# Altium schematic sheet Main.SchDoc
size A4
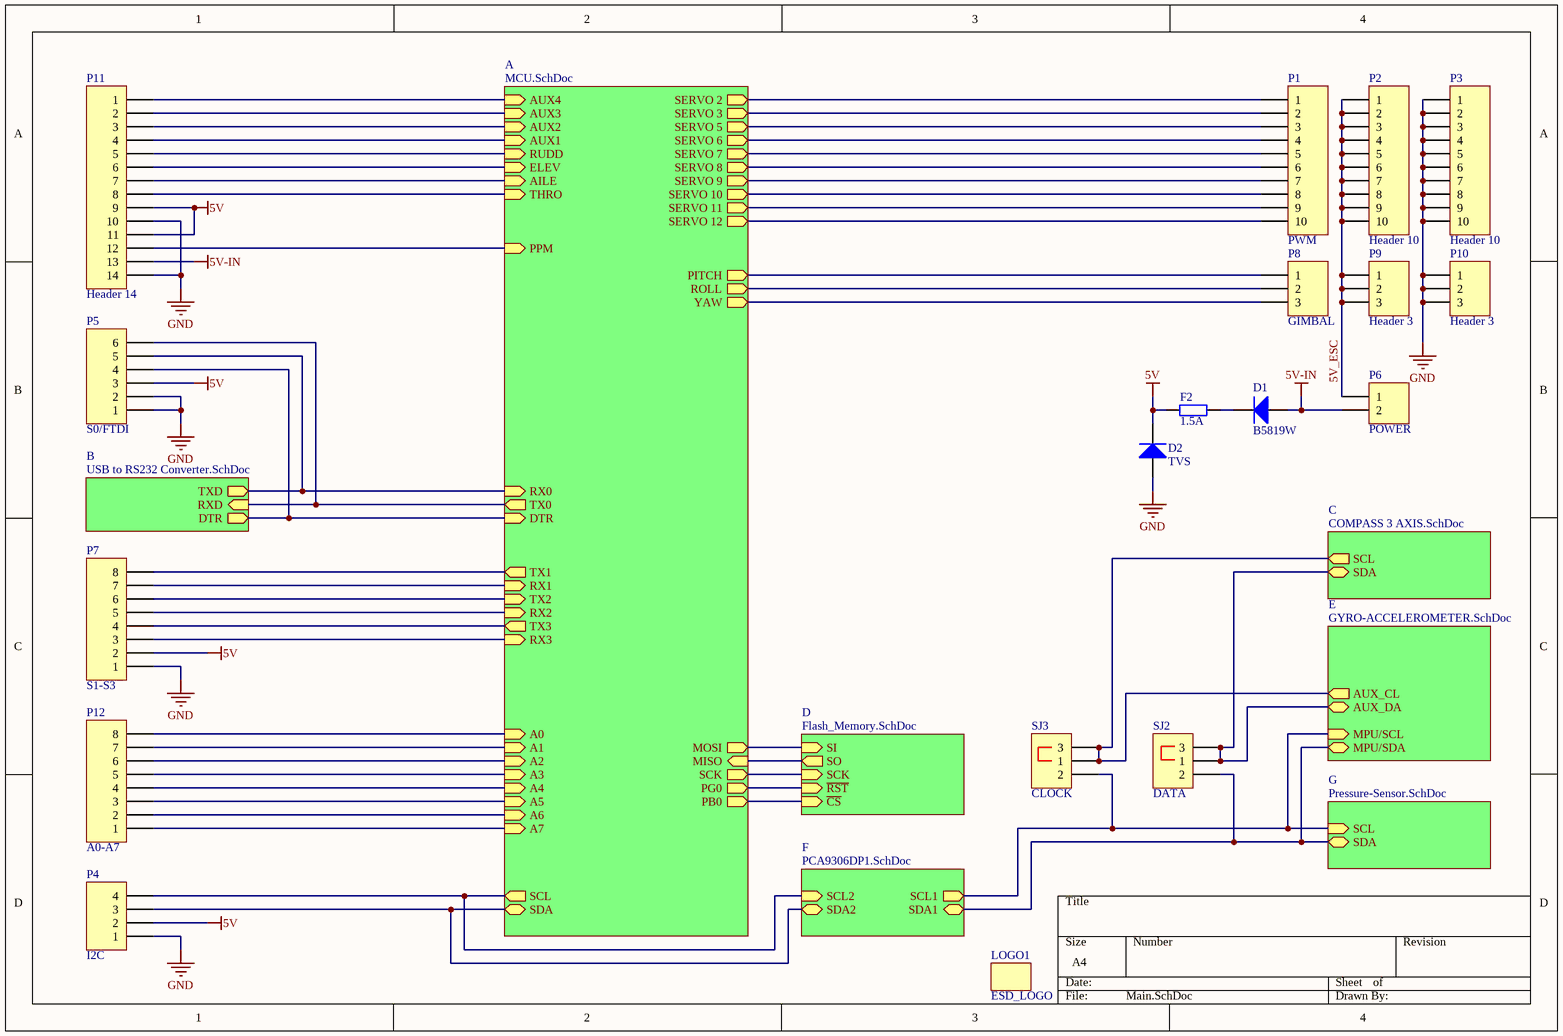
[diagram p0: Main.SchDoc]

## Parts
D1  B5819W  [SOD-123]
D2  TVS  [SOD-123]
F2  1.5A  [FUSE_1206(3216)]
LOGO1  ESD_LOGO  [LOGO_ESD]  (no BOM)
P1  PWM  [Pin Header 1x10 TH Pitch 2.54mm]
P2  Header 10  [Pin Header 1x10 TH Pitch 2.54mm]
P3  Header 10  [Pin Header 1x10 TH Pitch 2.54mm]
P4  I2C  [MOLEX-CONN-PicoBlade 4POS 1.25MM]
P5  S0/FTDI  [MOLEX-CONN-PicoBlade 6POS 1.25MM]
P6  POWER  [Pin Header S/M 02x1 TH Pitch 2.54mm]
P7  S1-S3  [MOLEX-CONN-PicoBlade 8POS 1.25MM]
P8  GIMBAL  [Pin Header 1x3 TH Pitch 2.54mm]
P9  Header 3  [Pin Header 1x3 TH Pitch 2.54mm]
P10  Header 3  [Pin Header 1x3 TH Pitch 2.54mm]
P11  Header 14  [Pin Header 1x14 TH Pitch 2.54mm]
P12  A0-A7  [MOLEX-CONN-PicoBlade 8POS 1.25MM]
SJ2  DATA  [JUMPER_3]
SJ3  CLOCK  [JUMPER_3]

## Sub-sheets
A = MCU.SchDoc: A5 (in), A4 (in), A7 (in), A2 (in), A0 (in), A3 (in), A6 (in), A1 (in), SERVO 10 (out), SERVO 2 (out), YAW (out), SERVO 6 (out), SERVO 9 (out), SERVO 8 (out), SERVO 5 (out), SERVO 3 (out), PITCH (out), SERVO 7 (out), ROLL (out), SERVO 12 (out), SERVO 11 (out), TX2 (in), RX1 (in), TX1 (out), TX3 (out), RX2 (in), RX3 (in), AILE (in), AUX1 (in), AUX4 (in), RUDD (in), AUX3 (in), THRO (in), AUX2 (in), ELEV (in), RX0 (in), TX0 (out), SCL (out), SDA (bidir), SCK (out), MOSI (out), MISO (in), PG0 (out), PB0 (out), PPM (in), DTR (in)
B = USB to RS232 Converter.SchDoc: TXD (out), RXD (in), DTR (out)
C = COMPASS 3 AXIS.SchDoc: SCL (out), SDA (bidir)
D = Flash_Memory.SchDoc: SO (out), ~{RST} (in), SCK (in), SI (in), ~{CS} (in)
E = GYRO-ACCELEROMETER.SchDoc: MPU/SDA (bidir), MPU/SCL (in), AUX_DA (bidir), AUX_CL (out)
F = PCA9306DP1.SchDoc: SDA1 (bidir), SDA2 (bidir), SCL1 (out), SCL2 (in)
G = Pressure-Sensor.SchDoc: SDA (bidir), SCL (in)

## Nets
5V: D2.1(A) F2.2 P4.2 P5.3 P7.2 P11.9 P11.11
5V-IN: D1.2(K) P6.2 P11.13
GND: D2.2(K) P3.1 P3.2 P3.3 P3.4 P3.5 P3.6 P3.7 P3.8 P3.9 P3.10 P4.1 P5.1 P5.2 P7.1 P10.1 P10.2 P10.3 P11.10 P11.14
5V_ESC: P2.1 P2.2 P2.3 P2.4 P2.5 P2.6 P2.7 P2.8 P2.9 P2.10 P6.1 P9.1 P9.2 P9.3
NetD1_1: D1.1(A) F2.1
NetP1_1: P1.1 ; sheet A/SERVO 2
NetP1_2: P1.2 ; sheet A/SERVO 3
NetP1_3: P1.3 ; sheet A/SERVO 5
NetP1_4: P1.4 ; sheet A/SERVO 6
NetP1_5: P1.5 ; sheet A/SERVO 7
NetP1_6: P1.6 ; sheet A/SERVO 8
NetP1_7: P1.7 ; sheet A/SERVO 9
NetP1_8: P1.8 ; sheet A/SERVO 10
NetP1_9: P1.9 ; sheet A/SERVO 11
NetP1_10: P1.10 ; sheet A/SERVO 12
NetP4_3: P4.3 ; sheet A/SDA, sheet F/SDA2
NetP4_4: P4.4 ; sheet A/SCL, sheet F/SCL2
NetP5_4: P5.4 ; sheet A/DTR, sheet B/DTR
NetP5_5: P5.5 ; sheet A/RX0, sheet B/TXD
NetP5_6: P5.6 ; sheet A/TX0, sheet B/RXD
NetP7_3: P7.3 ; sheet A/RX3
NetP7_4: P7.4 ; sheet A/TX3
NetP7_5: P7.5 ; sheet A/RX2
NetP7_6: P7.6 ; sheet A/TX2
NetP7_7: P7.7 ; sheet A/RX1
NetP7_8: P7.8 ; sheet A/TX1
NetP8_1: P8.1 ; sheet A/PITCH
NetP8_2: P8.2 ; sheet A/ROLL
NetP8_3: P8.3 ; sheet A/YAW
NetP11_1: P11.1 ; sheet A/AUX4
NetP11_2: P11.2 ; sheet A/AUX3
NetP11_3: P11.3 ; sheet A/AUX2
NetP11_4: P11.4 ; sheet A/AUX1
NetP11_5: P11.5 ; sheet A/RUDD
NetP11_6: P11.6 ; sheet A/ELEV
NetP11_7: P11.7 ; sheet A/AILE
NetP11_8: P11.8 ; sheet A/THRO
NetP11_12: P11.12 ; sheet A/PPM
NetP12_1: P12.1 ; sheet A/A7
NetP12_2: P12.2 ; sheet A/A6
NetP12_3: P12.3 ; sheet A/A5
NetP12_4: P12.4 ; sheet A/A4
NetP12_5: P12.5 ; sheet A/A3
NetP12_6: P12.6 ; sheet A/A2
NetP12_7: P12.7 ; sheet A/A1
NetP12_8: P12.8 ; sheet A/A0
NetSJ2_1: SJ2.1 SJ2.3 ; sheet C/SDA, sheet E/AUX_DA
NetSJ2_2: SJ2.2 ; sheet E/MPU/SDA, sheet F/SDA1, sheet G/SDA
NetSJ3_1: SJ3.1 SJ3.3 ; sheet C/SCL, sheet E/AUX_CL
NetSJ3_2: SJ3.2 ; sheet E/MPU/SCL, sheet F/SCL1, sheet G/SCL
(unnamed): sheet A/SCK, sheet D/SCK
(unnamed): sheet A/MOSI, sheet D/SI
(unnamed): sheet A/MISO, sheet D/SO
(unnamed): sheet A/PG0, sheet D/~{RST}
(unnamed): sheet A/PB0, sheet D/~{CS}

## Library data of the parts
D1 D2 = Diode: Default Diode; Published: 8-Jun-2000; LatestRevisionDate: 17-Jul-2002; LatestRevisionNote: Re-released for DXP Platform.; PackageVersion: Sep-1996; PackageReference: SMC; Publisher: Altium Limited; PackageDescription: DO-214-AB/SMC; 2 C-Bend Leads; Body 7.9 x 5.9 mm, inc. leads (LxW); Code_JEDEC: DO-214-AB
F2 = Res2: Ferrite Bead
LOGO1 = MECHANIC
P1-P3 = Header 10: Header, 10-Pin; LatestRevisionDate: 17-Jul-2002; LatestRevisionNote: Re-released for DXP Platform.; Publisher: Altium Limited
P4 = Header 4: Header, 4-Pin
P5 = Header 6: Header, 6-Pin
P6 = Header 2: Header, 2-Pin
P7 P12 = Header 8: Header, 8-Pin
P8-P10 SJ2 SJ3 = Header 3: Header, 3-Pin; LatestRevisionDate: 17-Jul-2002; LatestRevisionNote: Re-released for DXP Platform.; Publisher: Altium Limited
P11 = Header 14: Header, 14-Pin; LatestRevisionDate: 17-Jul-2002; LatestRevisionNote: Re-released for DXP Platform.; Publisher: Altium Limited